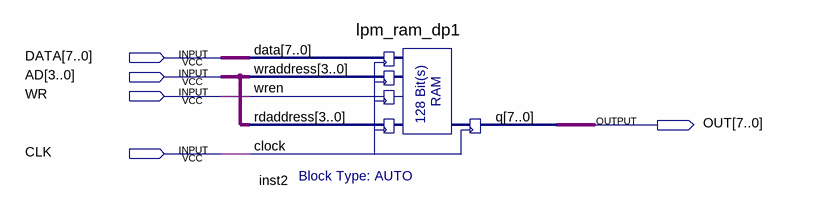
[diagram p0: schematic sheet]
// Quartus schematic register.bdf as structural Verilog: 1 symbols, 5 pins
module register (
  input  [7:0] DATA,
  input  [3:0] AD,
  input  WR,
  input  CLK,
  output [7:0] OUT
);

  lpm_ram_dp1 inst2 (.data(DATA), .wraddress(AD), .wren(WR), .rdaddress(AD), .clock(CLK), .q(OUT));
endmodule
